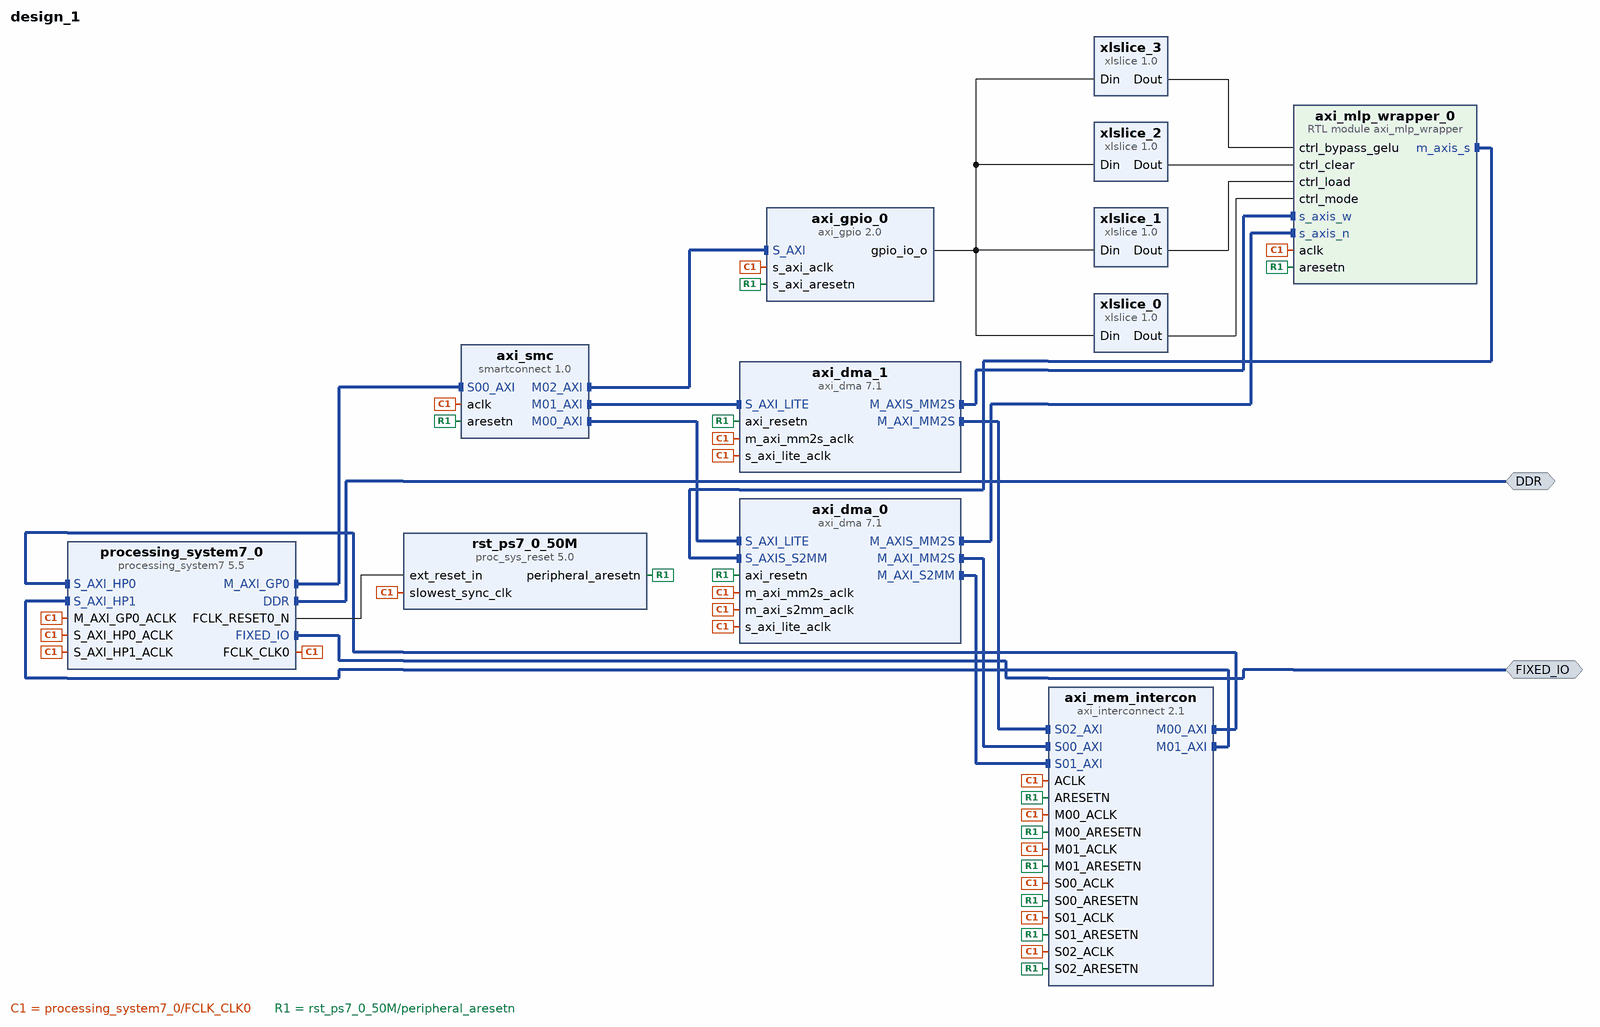
[diagram p0: block diagram of the top level]
# Vivado block design design_1, xc7z020clg400-1, Vivado 2025.1
create_bd_design design_1

create_bd_intf_port -mode Master -vlnv xilinx.com:interface:ddrx_rtl:1.0 DDR
create_bd_intf_port -mode Master -vlnv xilinx.com:display_processing_system7:fixedio_rtl:1.0 FIXED_IO

create_bd_cell -type module -reference axi_mlp_wrapper axi_mlp_wrapper_0
create_bd_cell -type ip -vlnv xilinx.com:ip:processing_system7:5.5 processing_system7_0
set_property -dict {CONFIG.PCW_USE_S_AXI_HP0 1 CONFIG.PCW_USE_S_AXI_HP1 1} [get_bd_cells processing_system7_0]
# 1 more settings of processing_system7_0 are not shown: defaults, MIO pin electricals, DDR timing, and values the tool derives
create_bd_cell -type ip -vlnv xilinx.com:ip:axi_dma:7.1 axi_dma_0
set_property -dict {CONFIG.c_include_sg 0} [get_bd_cells axi_dma_0]
create_bd_cell -type ip -vlnv xilinx.com:ip:axi_dma:7.1 axi_dma_1
set_property -dict {CONFIG.c_include_s2mm 0 CONFIG.c_include_sg 0} [get_bd_cells axi_dma_1]
create_bd_cell -type ip -vlnv xilinx.com:ip:axi_gpio:2.0 axi_gpio_0
set_property -dict {CONFIG.C_GPIO_WIDTH 4} [get_bd_cells axi_gpio_0]
create_bd_cell -type ip -vlnv xilinx.com:ip:xlslice:1.0 xlslice_0
set_property -dict {CONFIG.DIN_WIDTH 4} [get_bd_cells xlslice_0]
create_bd_cell -type ip -vlnv xilinx.com:ip:xlslice:1.0 xlslice_1
set_property -dict {CONFIG.DIN_FROM 1 CONFIG.DIN_TO 1} [get_bd_cells xlslice_1]
create_bd_cell -type ip -vlnv xilinx.com:ip:xlslice:1.0 xlslice_2
set_property -dict {CONFIG.DIN_FROM 2 CONFIG.DIN_TO 2 CONFIG.DIN_WIDTH 4} [get_bd_cells xlslice_2]
create_bd_cell -type ip -vlnv xilinx.com:ip:xlslice:1.0 xlslice_3
set_property -dict {CONFIG.DIN_FROM 3 CONFIG.DIN_TO 3 CONFIG.DIN_WIDTH 4} [get_bd_cells xlslice_3]
create_bd_cell -type ip -vlnv xilinx.com:ip:smartconnect:1.0 axi_smc
set_property -dict {CONFIG.NUM_MI 3 CONFIG.NUM_SI 1} [get_bd_cells axi_smc]
create_bd_cell -type ip -vlnv xilinx.com:ip:proc_sys_reset:5.0 rst_ps7_0_50M
create_bd_cell -type ip -vlnv xilinx.com:ip:axi_interconnect:2.1 axi_mem_intercon
set_property -dict {CONFIG.NUM_MI 2 CONFIG.NUM_SI 3} [get_bd_cells axi_mem_intercon]

# ---- connections ----

connect_bd_intf_net [get_bd_intf_pins axi_dma_0/M_AXIS_MM2S] [get_bd_intf_pins axi_mlp_wrapper_0/s_axis_n]
connect_bd_intf_net [get_bd_intf_pins axi_dma_0/M_AXI_MM2S] [get_bd_intf_pins axi_mem_intercon/S00_AXI]
connect_bd_intf_net [get_bd_intf_pins axi_dma_0/M_AXI_S2MM] [get_bd_intf_pins axi_mem_intercon/S01_AXI]
connect_bd_intf_net [get_bd_intf_pins axi_dma_1/M_AXIS_MM2S] [get_bd_intf_pins axi_mlp_wrapper_0/s_axis_w]
connect_bd_intf_net [get_bd_intf_pins axi_dma_1/M_AXI_MM2S] [get_bd_intf_pins axi_mem_intercon/S02_AXI]
connect_bd_intf_net [get_bd_intf_pins axi_mem_intercon/M00_AXI] [get_bd_intf_pins processing_system7_0/S_AXI_HP0]
connect_bd_intf_net [get_bd_intf_pins axi_mem_intercon/M01_AXI] [get_bd_intf_pins processing_system7_0/S_AXI_HP1]
connect_bd_intf_net [get_bd_intf_pins axi_mlp_wrapper_0/m_axis_s] [get_bd_intf_pins axi_dma_0/S_AXIS_S2MM]
connect_bd_intf_net [get_bd_intf_pins axi_smc/M00_AXI] [get_bd_intf_pins axi_dma_0/S_AXI_LITE]
connect_bd_intf_net [get_bd_intf_pins axi_smc/M01_AXI] [get_bd_intf_pins axi_dma_1/S_AXI_LITE]
connect_bd_intf_net [get_bd_intf_pins axi_smc/M02_AXI] [get_bd_intf_pins axi_gpio_0/S_AXI]
connect_bd_intf_net [get_bd_intf_ports DDR] [get_bd_intf_pins processing_system7_0/DDR]
connect_bd_intf_net [get_bd_intf_ports FIXED_IO] [get_bd_intf_pins processing_system7_0/FIXED_IO]
connect_bd_intf_net [get_bd_intf_pins processing_system7_0/M_AXI_GP0] [get_bd_intf_pins axi_smc/S00_AXI]
connect_bd_net [get_bd_pins axi_gpio_0/gpio_io_o] \
  [get_bd_pins xlslice_0/Din] [get_bd_pins xlslice_1/Din] [get_bd_pins xlslice_2/Din] [get_bd_pins xlslice_3/Din]
connect_bd_net [get_bd_pins processing_system7_0/FCLK_CLK0] \
  [get_bd_pins processing_system7_0/M_AXI_GP0_ACLK] [get_bd_pins axi_smc/aclk] [get_bd_pins axi_dma_0/s_axi_lite_aclk] \
  [get_bd_pins rst_ps7_0_50M/slowest_sync_clk] [get_bd_pins axi_dma_1/s_axi_lite_aclk] [get_bd_pins axi_gpio_0/s_axi_aclk] \
  [get_bd_pins axi_mlp_wrapper_0/aclk] [get_bd_pins axi_dma_0/m_axi_s2mm_aclk] [get_bd_pins axi_dma_0/m_axi_mm2s_aclk] \
  [get_bd_pins axi_dma_1/m_axi_mm2s_aclk] [get_bd_pins axi_mem_intercon/S00_ACLK] \
  [get_bd_pins processing_system7_0/S_AXI_HP0_ACLK] [get_bd_pins axi_mem_intercon/M00_ACLK] \
  [get_bd_pins axi_mem_intercon/ACLK] [get_bd_pins processing_system7_0/S_AXI_HP1_ACLK] \
  [get_bd_pins axi_mem_intercon/M01_ACLK] [get_bd_pins axi_mem_intercon/S01_ACLK] [get_bd_pins axi_mem_intercon/S02_ACLK]
connect_bd_net [get_bd_pins processing_system7_0/FCLK_RESET0_N] [get_bd_pins rst_ps7_0_50M/ext_reset_in]
connect_bd_net [get_bd_pins rst_ps7_0_50M/peripheral_aresetn] \
  [get_bd_pins axi_dma_0/axi_resetn] [get_bd_pins axi_smc/aresetn] [get_bd_pins axi_dma_1/axi_resetn] \
  [get_bd_pins axi_gpio_0/s_axi_aresetn] [get_bd_pins axi_mlp_wrapper_0/aresetn] [get_bd_pins axi_mem_intercon/S00_ARESETN] \
  [get_bd_pins axi_mem_intercon/M00_ARESETN] [get_bd_pins axi_mem_intercon/ARESETN] \
  [get_bd_pins axi_mem_intercon/M01_ARESETN] [get_bd_pins axi_mem_intercon/S01_ARESETN] \
  [get_bd_pins axi_mem_intercon/S02_ARESETN]
connect_bd_net [get_bd_pins xlslice_0/Dout] [get_bd_pins axi_mlp_wrapper_0/ctrl_mode]
connect_bd_net [get_bd_pins xlslice_1/Dout] [get_bd_pins axi_mlp_wrapper_0/ctrl_load]
connect_bd_net [get_bd_pins xlslice_2/Dout] [get_bd_pins axi_mlp_wrapper_0/ctrl_clear]
connect_bd_net [get_bd_pins xlslice_3/Dout] [get_bd_pins axi_mlp_wrapper_0/ctrl_bypass_gelu]

# ---- address map ----
assign_bd_address -offset 0x00000000 -range 256M -target_address_space [get_bd_addr_spaces axi_dma_0/Data_MM2S] [get_bd_addr_segs processing_system7_0/S_AXI_HP0/HP0_DDR_LOWOCM]
assign_bd_address -offset 0x10000000 -range 256M -target_address_space [get_bd_addr_spaces axi_dma_0/Data_MM2S] [get_bd_addr_segs processing_system7_0/S_AXI_HP1/HP1_DDR_LOWOCM]
assign_bd_address -offset 0x00000000 -range 256M -target_address_space [get_bd_addr_spaces axi_dma_0/Data_S2MM] [get_bd_addr_segs processing_system7_0/S_AXI_HP0/HP0_DDR_LOWOCM]
assign_bd_address -offset 0x10000000 -range 256M -target_address_space [get_bd_addr_spaces axi_dma_0/Data_S2MM] [get_bd_addr_segs processing_system7_0/S_AXI_HP1/HP1_DDR_LOWOCM]
assign_bd_address -offset 0x00000000 -range 256M -target_address_space [get_bd_addr_spaces axi_dma_1/Data_MM2S] [get_bd_addr_segs processing_system7_0/S_AXI_HP0/HP0_DDR_LOWOCM]
assign_bd_address -offset 0x10000000 -range 256M -target_address_space [get_bd_addr_spaces axi_dma_1/Data_MM2S] [get_bd_addr_segs processing_system7_0/S_AXI_HP1/HP1_DDR_LOWOCM]
assign_bd_address -offset 0x40400000 -range 64K -target_address_space [get_bd_addr_spaces processing_system7_0/Data] [get_bd_addr_segs axi_dma_0/S_AXI_LITE/Reg]
assign_bd_address -offset 0x40410000 -range 64K -target_address_space [get_bd_addr_spaces processing_system7_0/Data] [get_bd_addr_segs axi_dma_1/S_AXI_LITE/Reg]
assign_bd_address -offset 0x41200000 -range 64K -target_address_space [get_bd_addr_spaces processing_system7_0/Data] [get_bd_addr_segs axi_gpio_0/S_AXI/Reg]

validate_bd_design
save_bd_design
